# Altium schematic sheet Capx4.SchDoc
size A
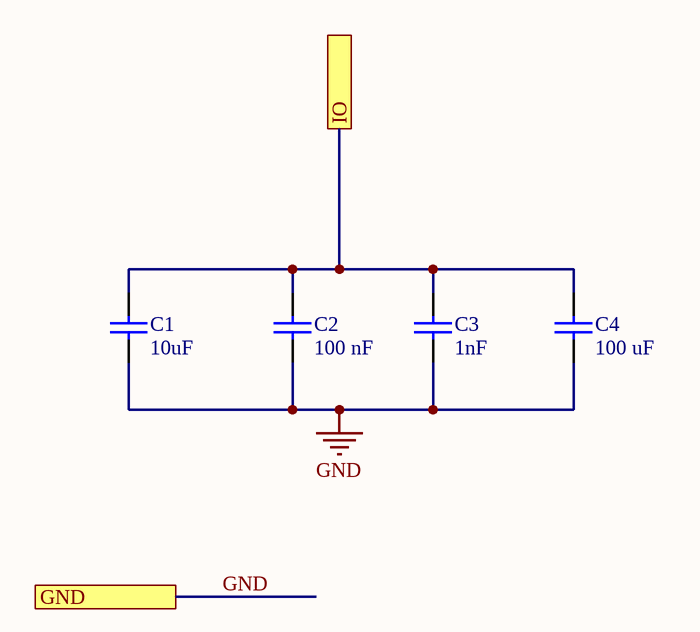
[diagram p0: Capx4.SchDoc]

## Parts
C1  value 10uF  [KEMET C0805C106K4PACTU]  (hidden comment: Cap 10uF 0805)
C2  value 100 nF  [KEMET C0805C104J8RACTU]  (hidden comment: Cap 100nF 0805)
C3  value 1nF  [Samsung CL21B Series]  (hidden comment: Cap 1nF 0805)
C4  value 100 uF  [KEMET C0805C104J8RACTU]  (hidden comment: Cap 100uF 0805)

## Ports
GND, IO

## Nets
GND: C1.2 C2.2 C3.2 C4.2 ; port GND
IO: C1.1 C2.1 C3.1 C4.1 ; port IO

## Library data of the parts
C1 = Cap 10uF 0805: CAP CER 10UF 16V X5R 0805 / ±10% 16V Ceramic Capacitor X5R 0805 (2012 Metric); Supplier 1: Digi-Key; Supplier Part Number 1: 399-4925-1-ND; Supplier 2: Digi-Key; Supplier Part Number 2: 399-11939-1-ND
C2 = Cap 100nF 0805: CAP CER 0.1UF 10V X7R 0805 / ±10% 10V Ceramic Capacitor X7R 0805 (2012 Metric); Supplier 1: Digi-Key; Supplier Part Number 1: 478-5311-1-ND
C3 = Cap 1nF 0805: Ceramic Capacitor, Multilayer, Ceramic, 50V, 10% +Tol, 10% -Tol, X7R, 15% TC, 0.001uF, Surface Mount, 0805; Supplier 1: Digi-Key; Supplier Part Number 1: 1276-2424-1-ND
C4 = Cap 100uF 0805: 100 µF ±20% 6.3V Ceramic Capacitor X5R 0805 (2012 Metric); Supplier 1: Newark; Supplier Part Number 1: 58Y4653